# Altium schematic sheet OMAPL137-HT.SchDoc
size A3; PartNumber: PNxxx; Drawn By: Me?
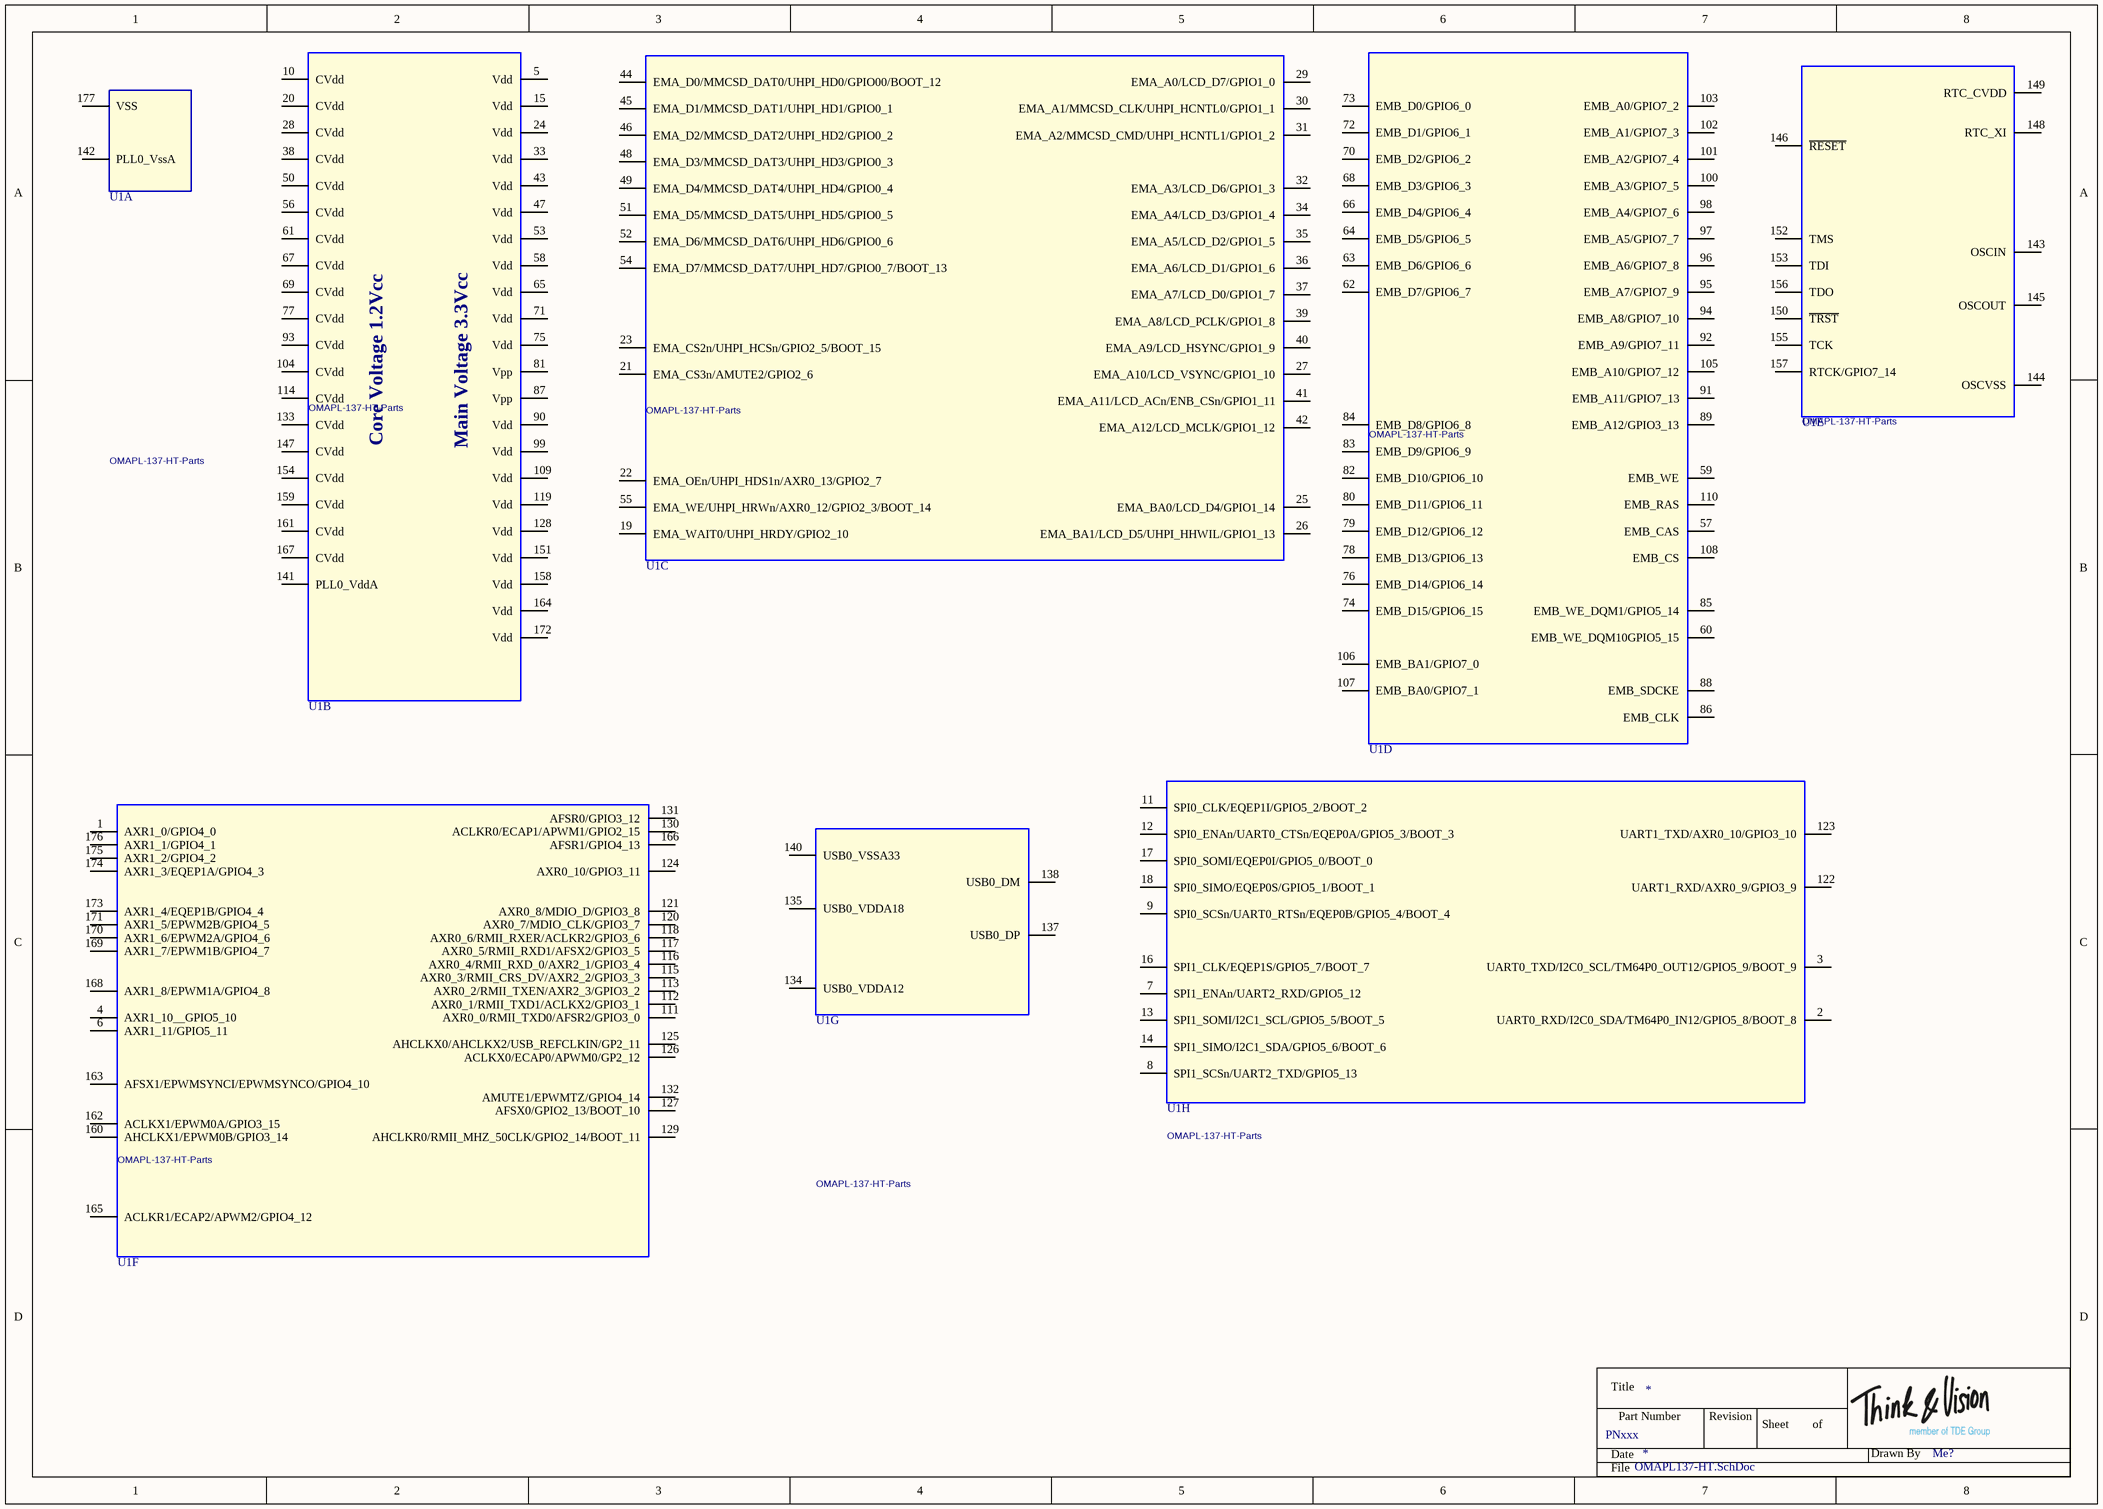
[diagram p0: OMAPL137-HT.SchDoc]

## Parts
U1  OMAPL-137-HT-Parts  [PTP176_5P73X7P00]  (parts A,B,C,D,E,F,G,H of 8)

## Nets

Not connected (* = marked no-connect by the designer): U1 1(AXR1_0/GPIO4_0) 2(UART0_RXD/I2C0_SDA/TM64P0_IN12/GPIO5_8/BOOT_8) 3(UART0_TXD/I2C0_SCL/TM64P0_OUT12/GPIO5_9/BOOT_9) 4(AXR1_10__GPIO5_10) 5(Vdd) 6(AXR1_11/GPIO5_11) 7(SPI1_ENAn/UART2_RXD/GPIO5_12) 8(SPI1_SCSn/UART2_TXD/GPIO5_13) 9(SPI0_SCSn/UART0_RTSn/EQEP0B/GPIO5_4/BOOT_4) 10(CVdd) 11(SPI0_CLK/EQEP1I/GPIO5_2/BOOT_2) 12(SPI0_ENAn/UART0_CTSn/EQEP0A/GPIO5_3/BOOT_3) 13(SPI1_SOMI/I2C1_SCL/GPIO5_5/BOOT_5) 14(SPI1_SIMO/I2C1_SDA/GPIO5_6/BOOT_6) 15(Vdd) 16(SPI1_CLK/EQEP1S/GPIO5_7/BOOT_7) 17(SPI0_SOMI/EQEP0I/GPIO5_0/BOOT_0) 18(SPI0_SIMO/EQEP0S/GPIO5_1/BOOT_1) 19(EMA_WAIT0/UHPI_HRDY/GPIO2_10) 20(CVdd) 21(EMA_CS3n/AMUTE2/GPIO2_6) 22(EMA_OEn/UHPI_HDS1n/AXR0_13/GPIO2_7) 23(EMA_CS2n/UHPI_HCSn/GPIO2_5/BOOT_15) 24(Vdd) 25(EMA_BA0/LCD_D4/GPIO1_14) 26(EMA_BA1/LCD_D5/UHPI_HHWIL/GPIO1_13) 27(EMA_A10/LCD_VSYNC/GPIO1_10) 28(CVdd) 29(EMA_A0/LCD_D7/GPIO1_0) 30(EMA_A1/MMCSD_CLK/UHPI_HCNTL0/GPIO1_1) 31(EMA_A2/MMCSD_CMD/UHPI_HCNTL1/GPIO1_2) 32(EMA_A3/LCD_D6/GPIO1_3) 33(Vdd) 34(EMA_A4/LCD_D3/GPIO1_4) 35(EMA_A5/LCD_D2/GPIO1_5) 36(EMA_A6/LCD_D1/GPIO1_6) 37(EMA_A7/LCD_D0/GPIO1_7) 38(CVdd) 39(EMA_A8/LCD_PCLK/GPIO1_8) 40(EMA_A9/LCD_HSYNC/GPIO1_9) 41(EMA_A11/LCD_ACn/ENB_CSn/GPIO1_11) 42(EMA_A12/LCD_MCLK/GPIO1_12) 43(Vdd) 44(EMA_D0/MMCSD_DAT0/UHPI_HD0/GPIO00/BOOT_12) 45(EMA_D1/MMCSD_DAT1/UHPI_HD1/GPIO0_1) 46(EMA_D2/MMCSD_DAT2/UHPI_HD2/GPIO0_2) 47(Vdd) 48(EMA_D3/MMCSD_DAT3/UHPI_HD3/GPIO0_3) 49(EMA_D4/MMCSD_DAT4/UHPI_HD4/GPIO0_4) 50(CVdd) 51(EMA_D5/MMCSD_DAT5/UHPI_HD5/GPIO0_5) 52(EMA_D6/MMCSD_DAT6/UHPI_HD6/GPIO0_6) 53(Vdd) 54(EMA_D7/MMCSD_DAT7/UHPI_HD7/GPIO0_7/BOOT_13) 55(EMA_WE/UHPI_HRWn/AXR0_12/GPIO2_3/BOOT_14) 56(CVdd) 57(EMB_CAS) 58(Vdd) 59(EMB_WE) 60(EMB_WE_DQM10GPIO5_15) 61(CVdd) 62(EMB_D7/GPIO6_7) 63(EMB_D6/GPIO6_6) 64(EMB_D5/GPIO6_5) 65(Vdd) 66(EMB_D4/GPIO6_4) 67(CVdd) 68(EMB_D3/GPIO6_3) 69(CVdd) 70(EMB_D2/GPIO6_2) 71(Vdd) 72(EMB_D1/GPIO6_1) 73(EMB_D0/GPIO6_0) 74(EMB_D15/GPIO6_15) 75(Vdd) 76(EMB_D14/GPIO6_14) 77(CVdd) 78(EMB_D13/GPIO6_13) 79(EMB_D12/GPIO6_12) 80(EMB_D11/GPIO6_11) 81(Vpp) 82(EMB_D10/GPIO6_10) 83(EMB_D9/GPIO6_9) 84(EMB_D8/GPIO6_8) 85(EMB_WE_DQM1/GPIO5_14) 86(EMB_CLK) 87(Vpp) 88(EMB_SDCKE) 89(EMB_A12/GPIO3_13) 90(Vdd) 91(EMB_A11/GPIO7_13) 92(EMB_A9/GPIO7_11) 93(CVdd) 94(EMB_A8/GPIO7_10) 95(EMB_A7/GPIO7_9) 96(EMB_A6/GPIO7_8) 97(EMB_A5/GPIO7_7) 98(EMB_A4/GPIO7_6) 99(Vdd) 100(EMB_A3/GPIO7_5) 101(EMB_A2/GPIO7_4) 102(EMB_A1/GPIO7_3) 103(EMB_A0/GPIO7_2) 104(CVdd) 105(EMB_A10/GPIO7_12) 106(EMB_BA1/GPIO7_0) 107(EMB_BA0/GPIO7_1) 108(EMB_CS) 109(Vdd) 110(EMB_RAS) 111(AXR0_0/RMII_TXD0/AFSR2/GPIO3_0) 112(AXR0_1/RMII_TXD1/ACLKX2/GPIO3_1) 113(AXR0_2/RMII_TXEN/AXR2_3/GPIO3_2) 114(CVdd) 115(AXR0_3/RMII_CRS_DV/AXR2_2/GPIO3_3) 116(AXR0_4/RMII_RXD_0/AXR2_1/GPIO3_4) 117(AXR0_5/RMII_RXD1/AFSX2/GPIO3_5) 118(AXR0_6/RMII_RXER/ACLKR2/GPIO3_6) 119(Vdd) 120(AXR0_7/MDIO_CLK/GPIO3_7) 121(AXR0_8/MDIO_D/GPIO3_8) 122(UART1_RXD/AXR0_9/GPIO3_9) 123(UART1_TXD/AXR0_10/GPIO3_10) 124(AXR0_10/GPIO3_11) 125(AHCLKX0/AHCLKX2/USB_REFCLKIN/GP2_11) 126(ACLKX0/ECAP0/APWM0/GP2_12) 127(AFSX0/GPIO2_13/BOOT_10) 128(Vdd) 129(AHCLKR0/RMII_MHZ_50CLK/GPIO2_14/BOOT_11) 130(ACLKR0/ECAP1/APWM1/GPIO2_15) 131(AFSR0/GPIO3_12) 132(AMUTE1/EPWMTZ/GPIO4_14) 133(CVdd) 134(USB0_VDDA12) 135(USB0_VDDA18) 137(USB0_DP) 138(USB0_DM) 140(USB0_VSSA33) 141(PLL0_VddA) 142(PLL0_VssA) 143(OSCIN) 144(OSCVSS) 145(OSCOUT) 146(~{RESET}) 147(CVdd) 148(RTC_XI) 149(RTC_CVDD) 150(~{TRST}) 151(Vdd) 152(TMS) 153(TDI) 154(CVdd) 155(TCK) 156(TDO) 157(RTCK/GPIO7_14) 158(Vdd) 159(CVdd) 160(AHCLKX1/EPWM0B/GPIO3_14) 161(CVdd) 162(ACLKX1/EPWM0A/GPIO3_15) 163(AFSX1/EPWMSYNCI/EPWMSYNCO/GPIO4_10) 164(Vdd) 165(ACLKR1/ECAP2/APWM2/GPIO4_12) 166(AFSR1/GPIO4_13) 167(CVdd) 168(AXR1_8/EPWM1A/GPIO4_8) 169(AXR1_7/EPWM1B/GPIO4_7) 170(AXR1_6/EPWM2A/GPIO4_6) 171(AXR1_5/EPWM2B/GPIO4_5) 172(Vdd) 173(AXR1_4/EQEP1B/GPIO4_4) 174(AXR1_3/EQEP1A/GPIO4_3) 175(AXR1_2/GPIO4_2) 176(AXR1_1/GPIO4_1) 177(VSS)

## Notes on the sheet
- Title
- Date
- Part Number
- Revision
- Sheet
- of
- Drawn By
- File
- (in symbol OMAPL-137-HT-Parts, part B) Core Voltage 1.2Vcc; Main Voltage 3.3Vcc

## Library data of the parts
U1 = OMAPL-137-HT-Parts: Manufacturer: TI; Manufacturer PartNr: OMAPL137BPTPH; TDE-PN: IC0081; Deliverer: *; Deliverer PartNr: *; Published: 10.08.2016; Publisher: Sebastian Kulik; Price: *